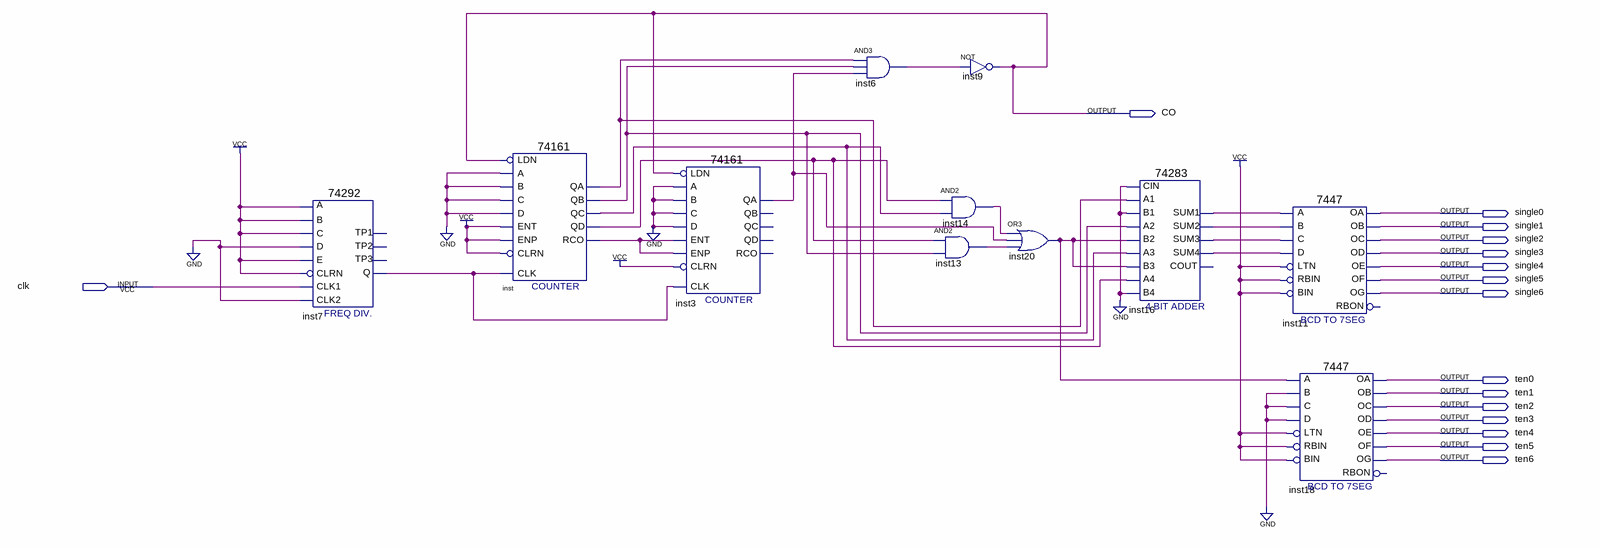
[diagram p0: schematic sheet]
// Quartus schematic FPGA2.bdf as structural Verilog: 11 symbols, 16 pins
module FPGA2 (
  input  clk,
  output CO,
  output single0,
  output single1,
  output single2,
  output single3,
  output single4,
  output single5,
  output single6,
  output ten0,
  output ten1,
  output ten2,
  output ten3,
  output ten4,
  output ten5,
  output ten6
);

  wire inst3_qa, inst6_out, inst7_q, inst13_out, inst14_out, inst16_sum1, inst16_sum2, inst16_sum3,
       inst16_sum4, inst20_out, inst_qa, inst_qb, inst_qc, inst_qd, inst_rco;

  \74292  inst7 (
    .A(1'b1), .D(1'b0), .C(1'b1), .B(1'b1), .CLK1(clk), .CLRN(1'b1), .E(1'b1), .CLK2(1'b0), .Q(inst7_q));  // open: TP2, TP1, TP3
  \74161  inst (
    .CLRN(1'b1), .CLK(inst7_q), .ENP(1'b1), .LDN(CO), .A(1'b0), .D(1'b0), .ENT(1'b1), .B(1'b0), .C(1'b0),
    .QD(inst_qd), .QC(inst_qc), .QB(inst_qb), .QA(inst_qa), .RCO(inst_rco));
  \74161  inst3 (
    .CLRN(1'b1), .CLK(inst7_q), .ENP(inst_rco), .LDN(CO), .A(1'b0), .D(1'b0), .ENT(inst_rco), .B(1'b0),
    .C(1'b0), .QA(inst3_qa));  // open: QD, QC, QB, RCO
  and inst6 (inst6_out, inst_qa, inst_qb, inst3_qa);
  not inst9 (CO, inst6_out);
  and inst14 (inst14_out, inst_qd, inst_qc);
  and inst13 (inst13_out, inst_qd, inst_qb);
  or inst20 (inst20_out, inst14_out, inst3_qa, inst13_out);
  \74283  inst16 (
    .CIN(1'b0), .A1(inst_qa), .A2(inst_qb), .B2(inst20_out), .A3(inst_qc), .A4(inst_qd), .B4(1'b0),
    .B1(1'b0), .B3(inst20_out), .SUM4(inst16_sum4), .SUM1(inst16_sum1), .SUM2(inst16_sum2), .SUM3(inst16_sum3));  // open: COUT
  \7447  inst11 (
    .LTN(1'b1), .B(inst16_sum2), .C(inst16_sum3), .D(inst16_sum4), .RBIN(1'b1), .BIN(1'b1), .A(inst16_sum1),
    .OB(single1), .OC(single2), .OE(single4), .OD(single3), .OF(single5), .OG(single6), .OA(single0));  // open: RBON
  \7447  inst18 (
    .LTN(1'b1), .B(1'b0), .C(1'b0), .D(1'b0), .RBIN(1'b1), .BIN(1'b1), .A(inst20_out), .OB(ten1), .OC(ten2),
    .OE(ten4), .OD(ten3), .OF(ten5), .OG(ten6), .OA(ten0));  // open: RBON
endmodule
